# Altium project CW308T_AVR.PrjPcb
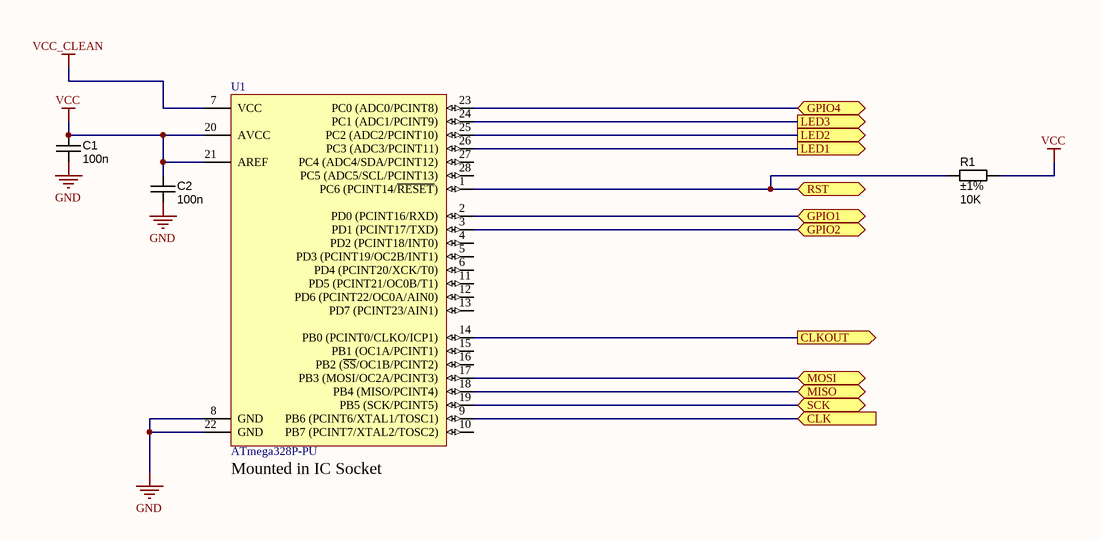
[diagram p0: CW308T_AVR_MICRO.SchDoc]
PrjLicense: GPL; PrjName: CW308T-AVR; PrjRev: 02
2 sheets, 14 parts. Net scope: flat (ports and power ports of the same name join across sheets).
Board file: CW308T_AVR.PcbDoc
Sheets:
  CW308T_AVR_MICRO.SchDoc
  CW308T_AVR_CONN.SchDoc

## Sheet CW308T_AVR_MICRO.SchDoc: AVR Microcontroller
size Letter; Organization: NewAE Technology Inc.; Address1: 1083 Queen St., Suite 196; Address2: Halifax; Address3: NS; Address4: Canada B3H 0B2; SheetNumber: 1; SheetTotal: 2; SheetApproved: YES

### Parts
C1  value 100n  [CAPC1608X90N]  (hidden comment: approved sub OK)
C2  value 100n  [CAPC1608X90N]  (hidden comment: approved sub OK)
R1  value 10K  Tolerance: ±1%  [RESC1608X55N]  (hidden comment: Thick Film)
U1  ATmega328P-PU  [28P3]

### Ports
CLK (in), CLKOUT (out), GPIO1 (bidir), GPIO2 (bidir), GPIO4 (bidir), LED1 (out), LED2 (out), LED3 (out), MISO (bidir), MOSI (bidir), RST (bidir), SCK (bidir)

### Nets
GND: C1.2 C2.2 U1.8(GND) U1.22(GND)
VCC: C1.1 C2.1 R1.1 U1.20(AVCC) U1.21(AREF)  [project net FILTIN]
VCC_CLEAN: U1.7(VCC)  [project net SHUNTL]
GPIO1/TX: U1.2(PD0_(PCINT16/RXD)) ; port GPIO1
GPIO2/RX: U1.3(PD1_(PCINT17/TXD)) ; port GPIO2
GPIO4/TRIG: U1.23(PC0_(ADC0/PCINT8)) ; port GPIO4
LED1: U1.26(PC3_(ADC3/PCINT11)) ; port LED1
LED2: U1.25(PC2_(ADC2/PCINT10)) ; port LED2
LED3: U1.24(PC1_(ADC1/PCINT9)) ; port LED3
MISO: U1.18(PB4_(MISO/PCINT4)) ; port MISO
MOSI: U1.17(PB3_(MOSI/OC2A/PCINT3)) ; port MOSI
nRST: R1.2 U1.1(PC6_(PCINT14/~{RESET})) ; port RST
SCK: U1.19(PB5_(SCK/PCINT5)) ; port SCK
NetR2_1: U1.9(PB6_(PCINT6/XTAL1/TOSC1)) ; port CLK
NetR4_1: U1.14(PB0_(PCINT0/CLKO/ICP1)) ; port CLKOUT

Not connected (* = marked no-connect by the designer): U1 4(PD2_(PCINT18/INT0)) 5(PD3_(PCINT19/OC2B/INT1)) 6(PD4_(PCINT20/XCK/T0)) 10(PB7_(PCINT7/XTAL2/TOSC2)) 11(PD5_(PCINT21/OC0B/T1)) 12(PD6_(PCINT22/OC0A/AIN0)) 13(PD7_(PCINT23/AIN1)) 15(PB1_(OC1A/PCINT1)) 16(PB2_(~{SS}/OC1B/PCINT2)) 27(PC4_(ADC4/SDA/PCINT12)) 28(PC5_(ADC5/SCL/PCINT13))

### Notes on the sheet
- (near U1) Mounted in IC Socket
- Title:
- Date:
- Rev:
- Time:
- Project:
- Sheet
- of
- License:
- Copyright © NewAE Technology Inc.
- Approved:
- NewAE.com
- File:

### Library data of the parts
C1 C2 = CAPC_100n_0603_X7R_50V_10%: Capacitor SMD Cer 100nF 10% 50V X7R 0603; Manufacturer 1: AVX Corporation; Manufacturer Part Number 1: 06035C104KAT2A; Ratings: 50V; X7R; Material: ceramic; SCDType: spec; Manufacturer 2: TDK Corporation; Manufacturer Part Number 2: C1608X7R1H104K; Package / Case: 0603 (1608 Metric); Tolerance: ±10%; Supplier 1: Digi-Key; Supplier Part Number 1: 478-5052-1-ND; ComponentLink1URL: http://www.avx.com/docs/Catalogs/cx7r.pdf; ComponentLink1Description: http://www.avx.com/docs/Catalogs/cx7r.pdf; Supplier 2: Digi-Key; Supplier Part Number 2: 445-1314-1-ND; ComponentLink2URL: http://product.tdk.com/capacitor/mlcc/en/documents/mlcc_commercial_general_en.pdf; ComponentLink2Description: http://product.tdk.com/capacitor/mlcc/en/documents/mlcc_commercial_general_en.pdf
R1 = RES_10K_0603_1%: Resistor SMD chip 10k Ohm 0.1W 1% 0603; Manufacturer 1: Yageo; Manufacturer Part Number 1: RC0603FR-0710KL; Ratings: 1/10W; SCDType: spec; Package / Case: 0603 (1608 Metric); Supplier 1: Digi-Key; Supplier Part Number 1: 311-10.0KHRCT-ND
U1 = CMP-0095-00013-2: 8-bit AVR Microcontroller, 32KB Flash, 1KB EEPROM, 2KB SRAM, 28-pin PDIP, Industrial Grade (-40°C to 85°C); RevisionNote: DatasheetVersion updated. URLs added.; PackageVersion: revB, Sep-2001; DatasheetVersion: revD, May-2011; ComponentLink1Description: Manufacturer URL; ComponentLink1URL: http://www.atmel.com/; PackageReference: 28P3; ComponentLink2Description: ATmega48A/48PA/88A/88PA/168A/168PA/328/328P Datasheet; ComponentLink3URL: http://www.atmel.com/dyn/resources/prod_documents/8271S.pdf; ComponentLink2URL: http://www.atmel.com/dyn/resources/prod_documents/8271.pdf; ComponentLink3Description: ATmega48A/48PA/88A/88PA/168A/168PA/328/328P Summary

## Sheet CW308T_AVR_CONN.SchDoc: CW308 Connections
size Letter; Organization: NewAE Technology Inc.; Address1: 1083 Queen St., Suite 196; Address2: Halifax; Address3: NS; Address4: Canada B3H 0B2; SheetNumber: 2; SheetTotal: 2; SheetApproved: YES
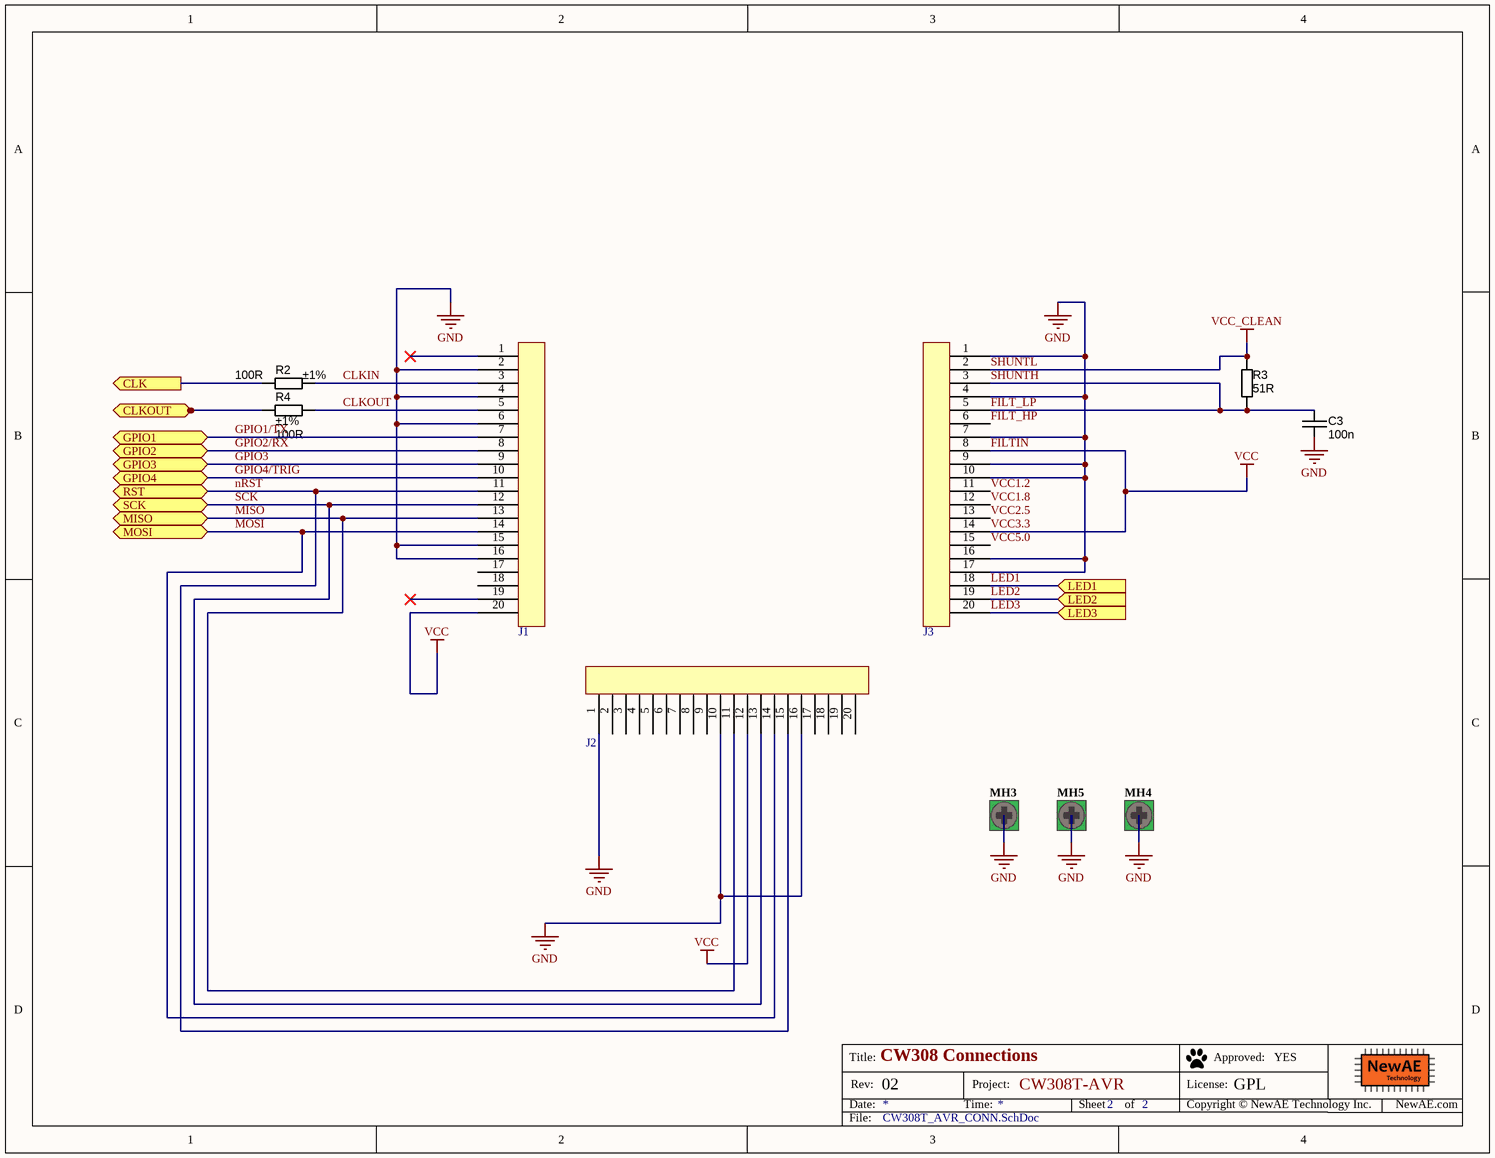
[diagram p1: CW308T_AVR_CONN.SchDoc]

### Parts
C3  value 100n  [CAPC1608X90N]  (hidden comment: approved sub OK)
J1  20-Pin Header  [801-87-020-10-001101]  (value not drawn)
J2  20-Pin Header  [801-87-020-10-001101]  (value not drawn)
J3  20-Pin Header  [801-87-020-10-001101]  (value not drawn)
MH3  Mounting-Hole-RND-Altium  [Mounting-Hole-RND-Altium]  (value not drawn)  (no BOM)
MH4  Mounting-Hole-RND-Altium  [Mounting-Hole-RND-Altium]  (value not drawn)  (no BOM)
MH5  Mounting-Hole-RND-Altium  [Mounting-Hole-RND-Altium]  (value not drawn)  (no BOM)
R2  value 100R  Tolerance: ±1%  [RESC1608X55N]  (hidden comment: Thick Film)
R3  value 51R  [RESC2012X70N]  (hidden comment: Thick Film)
R4  value 100R  Tolerance: ±1%  [RESC1608X55N]  (hidden comment: Thick Film)

### Ports
CLK (out), CLKOUT (in), GPIO1 (bidir), GPIO2 (bidir), GPIO3 (bidir), GPIO4 (bidir), LED1 (in), LED2 (in), LED3 (in), MISO (bidir), MOSI (bidir), RST (bidir), SCK (bidir)

### Nets
FILTIN: J1.20 J2.12 J3.8 J3.14  [also labelled VCC, VCC3.3]
GND: C3.2 J1.2 J1.4 J1.6 J1.15 J1.16 J2.1 J2.10 J2.16 J3.1 J3.4 J3.7 J3.9 J3.10 J3.16 J3.17 MH3.1 MH4.1 MH5.1
SHUNTL: J3.2 R3.1  [also labelled VCC_CLEAN]
CLKIN: J1.3 R2.2
CLKOUT: J1.5 R4.2
FILT_HP: J3.6
FILT_LP: C3.1 J3.3 J3.5 R3.2  [also labelled SHUNTH]
GPIO1/TX: J1.7 ; port GPIO1
GPIO2/RX: J1.8 ; port GPIO2
GPIO3: J1.9 ; port GPIO3
GPIO4/TRIG: J1.10 ; port GPIO4
LED1: J3.18 ; port LED1
LED2: J3.19 ; port LED2
LED3: J3.20 ; port LED3
MISO: J1.13 J2.11 ; port MISO
MOSI: J1.14 J2.14 ; port MOSI
nRST: J1.11 J2.15 ; port RST
SCK: J1.12 J2.13 ; port SCK
VCC1.2: J3.11
VCC1.8: J3.12
VCC2.5: J3.13
VCC5.0: J3.15
NetR2_1: R2.1 ; port CLK
NetR4_1: R4.1 ; port CLKOUT

Not connected (* = marked no-connect by the designer): J1 1* 17 18 19*; J2 2 3 4 5 6 7 8 9 17 18 19 20

### Notes on the sheet
- Title:
- Date:
- Rev:
- Time:
- Project:
- Sheet
- of
- License:
- Copyright © NewAE Technology Inc.
- Approved:
- NewAE.com
- File:

### Library data of the parts
C3 = CAPC_100n_0603_X7R_50V_10%: as C1 on sheet CW308T_AVR_MICRO; Manufacturer 2: TDK Corporation; Manufacturer Part Number 2: C1608X7R1H104K; Package / Case: 0603 (1608 Metric); Tolerance: ±10%; Supplier 1: Digi-Key; Supplier Part Number 1: 478-5052-1-ND; ComponentLink1URL: http://www.avx.com/docs/Catalogs/cx7r.pdf; ComponentLink1Description: http://www.avx.com/docs/Catalogs/cx7r.pdf; Supplier 2: Digi-Key; Supplier Part Number 2: 445-1314-1-ND; ComponentLink2URL: http://product.tdk.com/capacitor/mlcc/en/documents/mlcc_commercial_general_en.pdf; ComponentLink2Description: http://product.tdk.com/capacitor/mlcc/en/documents/mlcc_commercial_general_en.pdf
J1-J3 = 801-87-020-10-001101: 1x20 Header, Machined; Manufacture 1: Preci-Dip SA; Manufacture Part Number 1: 801-87-020-10-001101; Supplier 1: Digi-Key; Supplier Part Number 1: 1212-1207-ND
MH3-MH5 = CMP-0001-00029-1: Mounting Hole, Altium, 4.4mm pad, 3.4mm plated hole; Publisher: Altium; ClassName: Mounting Hole
R2 R4 = RES_100R_0603_1%: Resistor SMD chip 100 Ohm 0.1W 1% 0603; Manufacturer 1: Yageo; Manufacturer Part Number 1: RC0603FR-07100RL; Ratings: 1/10 W; SCDType: spec; Package / Case: 0603 (1608 Metric); Material: Thick Film; Supplier 1: Digi-Key; Supplier Part Number 1: 311-100HRCT-ND; Supplier 2: Digi-Key; Supplier Part Number 2: P100HTR-ND; Manufacturer 2: Panasonic - ECG; Manufacturer Part Number 2: ERJ-3EKF1000V; ComponentLink1URL: http://industrial.panasonic.com/www-cgi/jvcr13pz.cgi?E+PZ+3+AOA0002+ERJ3EKF1000V+7+WW; ComponentLink1Description: http://industrial.panasonic.com/www-cgi/jvcr13pz.cgi?E+PZ+3+AOA0002+ERJ3EKF1000V+7+WW
R3 = RES_15R_0805_5%: Resistor SMD chip 15 Ohm 0.125W 5% 0805; Manufacturer 1: Yageo; Manufacturer Part Number 1: RC0805JR-0715RL; Ratings: 1/8W; SCDType: spec; Tolerance: ±5%; Package / Case: 0805 (2012 metric); Supplier 1: Digi-Key; Supplier Part Number 1: 311-15ARCT-ND; RoHS 1: RoHS Compliant; ComponentLink1URL: http://media.digikey.com/pdf/Data%20Sheets/Yageo%20PDFs/RC0805%20Pb%20Free.pdf; ComponentLink1Description: http://media.digikey.com/pdf/Data%20Sheets/Yageo%20PDFs/RC0805%20Pb%20Free.pdf; Supplier 2: Digi-Key; Supplier Part Number 2: P15ACT-ND; Manufacturer 2: Panasonic Electronic Components; Manufacturer Part Number 2: ERJ-6GEYJ150V; RoHS 2: RoHS Compliant; ComponentLink2URL: http://industrial.panasonic.com/www-cgi/jvcr13pz.cgi?E+PZ+3+AOA0001+ERJ6GEYJ150V+7+WW; ComponentLink2Description: http://industrial.panasonic.com/www-cgi/jvcr13pz.cgi?E+PZ+3+AOA0001+ERJ6GEYJ150V+7+WW; Supplier 3: Digi-Key; Supplier Part Number 3: RMCF0805JT15R0CT-ND; Manufacturer 3: Stackpole Electronics Inc; Manufacturer Part Number 3: RMCF0805JT15R0; RoHS 3: RoHS Compliant; ComponentLink3URL: http://www.seielect.com/Catalog/SEI-RMCF_RMCP.pdf; ComponentLink3Description: http://www.seielect.com/Catalog/SEI-RMCF_RMCP.pdf; Supplier 4: Digi-Key; Supplier Part Number 4: 541-15ACT-ND; Manufacturer 4: Vishay Dale; Manufacturer Part Number 4: CRCW080515R0JNEA; RoHS 4: RoHS Compliant; ComponentLink4URL: http://www.vishay.com/doc?20035; ComponentLink4Description: http://www.vishay.com/doc?20035

## Nets that join several sheets
FILTIN: CW308T_AVR_MICRO (5 pins), CW308T_AVR_CONN (J1.20 J2.12 J3.8 J3.14)
GND: CW308T_AVR_MICRO (C1.2 C2.2 U1.8 U1.22), CW308T_AVR_CONN (19 pins)
SHUNTL: CW308T_AVR_MICRO (U1.7), CW308T_AVR_CONN (J3.2 R3.1)
GPIO1/TX: CW308T_AVR_MICRO (U1.2), CW308T_AVR_CONN (J1.7)
GPIO2/RX: CW308T_AVR_MICRO (U1.3), CW308T_AVR_CONN (J1.8)
GPIO4/TRIG: CW308T_AVR_MICRO (U1.23), CW308T_AVR_CONN (J1.10)
LED1: CW308T_AVR_MICRO (U1.26), CW308T_AVR_CONN (J3.18)
LED2: CW308T_AVR_MICRO (U1.25), CW308T_AVR_CONN (J3.19)
LED3: CW308T_AVR_MICRO (U1.24), CW308T_AVR_CONN (J3.20)
MISO: CW308T_AVR_MICRO (U1.18), CW308T_AVR_CONN (J1.13 J2.11)
MOSI: CW308T_AVR_MICRO (U1.17), CW308T_AVR_CONN (J1.14 J2.14)
NetR2_1: CW308T_AVR_MICRO (U1.9), CW308T_AVR_CONN (R2.1)
NetR4_1: CW308T_AVR_MICRO (U1.14), CW308T_AVR_CONN (R4.1)
nRST: CW308T_AVR_MICRO (R1.2 U1.1), CW308T_AVR_CONN (J1.11 J2.15)
SCK: CW308T_AVR_MICRO (U1.19), CW308T_AVR_CONN (J1.12 J2.13)